# Altium schematic sheet Receptor U.SchDoc
size A4
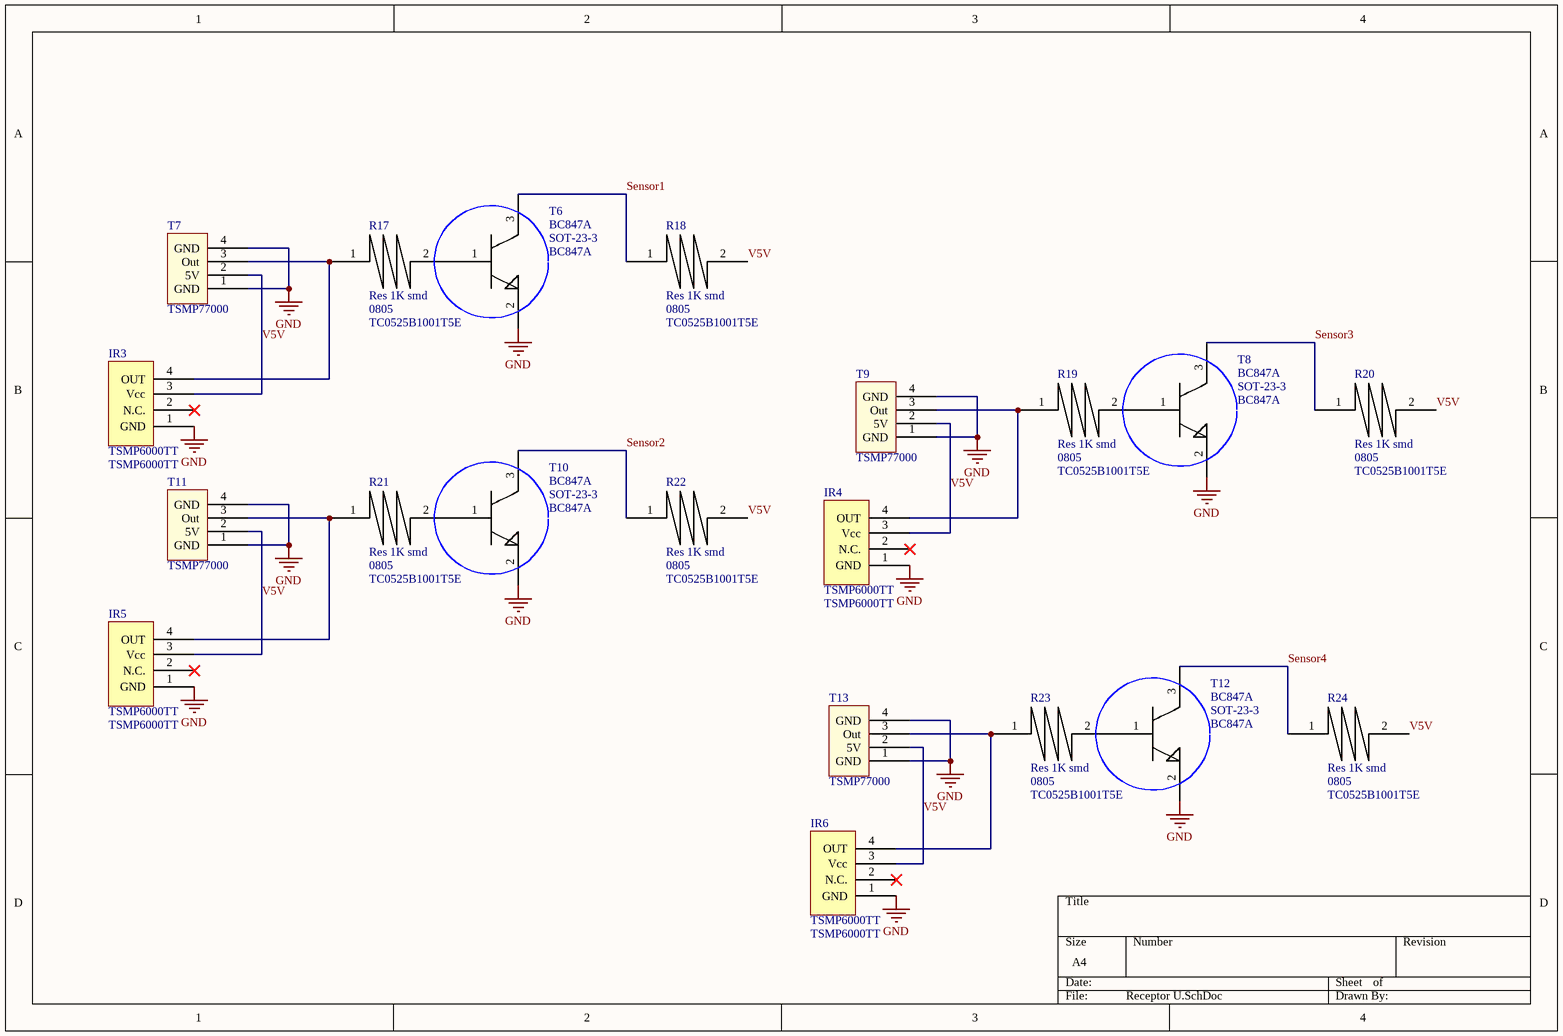
[diagram p0: Receptor U.SchDoc]

## Parts
IR3  TSMP6000TT  [TSMP6000TT]
IR4  TSMP6000TT  [TSMP6000TT]
IR5  TSMP6000TT  [TSMP6000TT]
IR6  TSMP6000TT  [TSMP6000TT]
R17  Res 1K smd  Package: 0805  MFR.Part #: TC0525B1001T5E  [RES 1K]
R18  Res 1K smd  Package: 0805  MFR.Part #: TC0525B1001T5E  [RES 1K]
R19  Res 1K smd  Package: 0805  MFR.Part #: TC0525B1001T5E  [RES 1K]
R20  Res 1K smd  Package: 0805  MFR.Part #: TC0525B1001T5E  [RES 1K]
R21  Res 1K smd  Package: 0805  MFR.Part #: TC0525B1001T5E  [RES 1K]
R22  Res 1K smd  Package: 0805  MFR.Part #: TC0525B1001T5E  [RES 1K]
R23  Res 1K smd  Package: 0805  MFR.Part #: TC0525B1001T5E  [RES 1K]
R24  Res 1K smd  Package: 0805  MFR.Part #: TC0525B1001T5E  [RES 1K]
T6  BC847A  Package: SOT-23-3  [BC847A]
T7  TSMP77000  [TSMP77000]
T8  BC847A  Package: SOT-23-3  [BC847A]
T9  TSMP77000  [TSMP77000]
T10  BC847A  Package: SOT-23-3  [BC847A]
T11  TSMP77000  [TSMP77000]
T12  BC847A  Package: SOT-23-3  [BC847A]
T13  TSMP77000  [TSMP77000]

## Nets
GND: IR3.1(GND) IR4.1(GND) IR5.1(GND) IR6.1(GND) T6.2 T7.1(GND) T7.4(GND) T8.2 T9.1(GND) T9.4(GND) T10.2 T11.1(GND) T11.4(GND) T12.2 T13.1(GND) T13.4(GND)
Sensor1: R18.1 T6.3
Sensor2: R22.1 T10.3
Sensor3: R20.1 T8.3
Sensor4: R24.1 T12.3
V5V: IR3.3(Vcc) IR4.3(Vcc) IR5.3(Vcc) IR6.3(Vcc) R18.2 R20.2 R22.2 R24.2 T7.2(5V) T9.2(5V) T11.2(5V) T13.2(5V)
NetIR3_4: IR3.4(OUT) R17.1 T7.3(Out)
NetIR4_4: IR4.4(OUT) R19.1 T9.3(Out)
NetIR5_4: IR5.4(OUT) R21.1 T11.3(Out)
NetIR6_4: IR6.4(OUT) R23.1 T13.3(Out)
NetR17_2: R17.2 T6.1
NetR19_2: R19.2 T8.1
NetR21_2: R21.2 T10.1
NetR23_2: R23.2 T12.1

Not connected (* = marked no-connect by the designer): IR3 2(N.C.)*; IR4 2(N.C.)*; IR5 2(N.C.)*; IR6 2(N.C.)*

## Library data of the parts
IR3-IR6 = TSMP6000TT: Mouser: https://www.mouser.mx/ProductDetail/Vishay-Semiconductors/TSMP6000TT?qs=N%2FGwOzoYEAATz68ZRXkk4Q%3D%3D; DGK: https://www.digikey.com.mx/es/products/detail/vishay-semiconductor-opto-division/TSMP6000TT/4696166; Part: TSMP6000TT
T6 T8 T10 T12 = BC847A: MFR.Part #: BC847A
T7 T9 T11 T13 = TSMP77000: # Parte: TSMP77000; Link: https://www.mouser.mx/datasheet/2/427/VISH_S_A0012397601_1-2572564.pdf